# Altium schematic sheet interface_temperature.SchDoc
size A; SheetNumber: 20
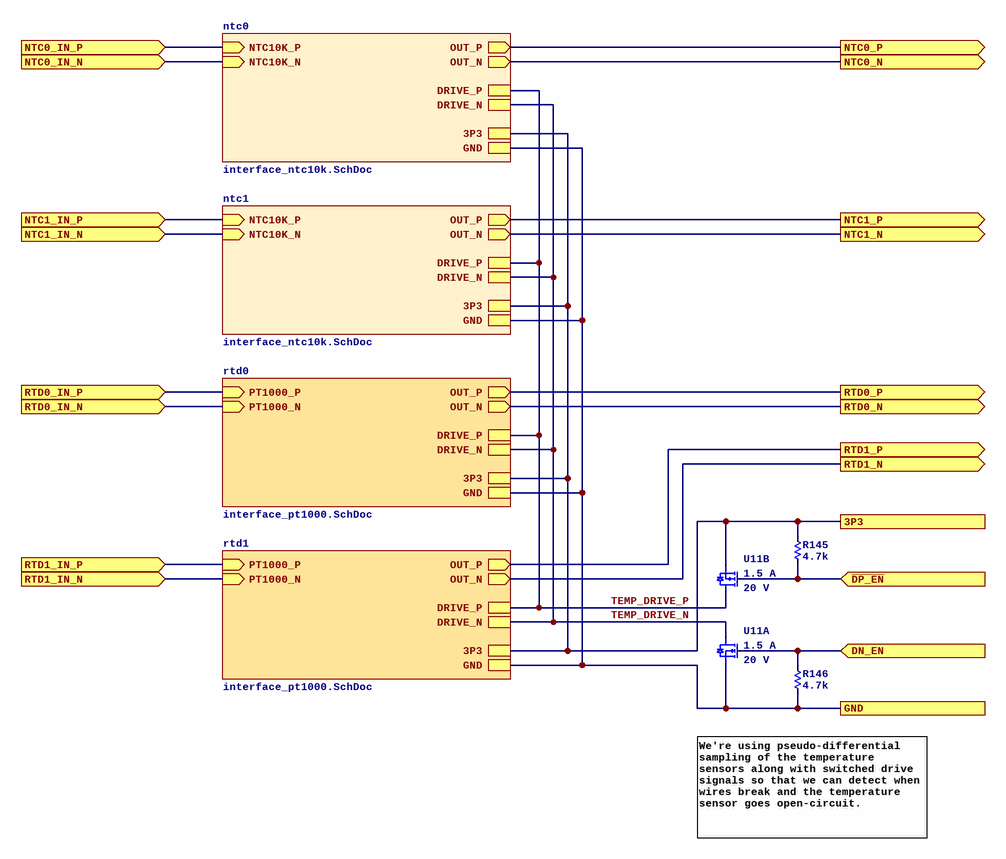
[diagram p0: interface_temperature.SchDoc]

## Parts
R145  Resistance: 4.7k  [R0402_0.40MM]  (hidden comment: ERJ-2RKF4701X)
R146  Resistance: 4.7k  [R0402_0.40MM]  (hidden comment: ERJ-2RKF4701X)
U11  Current: 1.5 A  Voltage: 20 V  [6TSOT23]  (hidden comment: BSL215CH6327XTSA1)  (parts A,B of 2)

## Sub-sheets
ntc0 = interface_ntc10k.SchDoc: 3P3, GND, DRIVE_N, DRIVE_P, OUT_P (out), OUT_N (out), NTC10K_P (in), NTC10K_N (in)
ntc1 = interface_ntc10k.SchDoc: 3P3, GND, DRIVE_N, DRIVE_P, OUT_P (out), OUT_N (out), NTC10K_P (in), NTC10K_N (in)
rtd0 = interface_pt1000.SchDoc: 3P3, GND, PT1000_P (in), PT1000_N (in), DRIVE_N, DRIVE_P, OUT_P (out), OUT_N (out)
rtd1 = interface_pt1000.SchDoc: 3P3, GND, PT1000_P (in), PT1000_N (in), DRIVE_N, DRIVE_P, OUT_P (out), OUT_N (out)

## Ports
3P3, DN_EN (in), GND, NTC0_IN_N (in), NTC0_IN_P (in), NTC0_N (out), NTC0_P (out), NTC1_IN_N (in), NTC1_IN_P (in), NTC1_N (out), NTC1_P (out), RTD0_IN_N (in), RTD0_IN_P (in), RTD0_N (out), RTD0_P (out), RTD1_IN_N (in), RTD1_IN_P (in), RTD1_N (out), RTD1_P (out), ~{DP_EN} (in)

## Nets
3P3: R145.1 U11.2 ; port 3P3, sheet ntc0/3P3, sheet rtd0/3P3, sheet ntc1/3P3, sheet rtd1/3P3
~{DP_EN}: R145.2 U11.3 ; port ~{DP_EN}
DN_EN: R146.1 U11.1 ; port DN_EN
GND: R146.2 U11.5 ; port GND, sheet ntc0/GND, sheet rtd0/GND, sheet ntc1/GND, sheet rtd1/GND
NTC0_IN_N: port NTC0_IN_N, sheet ntc0/NTC10K_N
NTC0_IN_P: port NTC0_IN_P, sheet ntc0/NTC10K_P
NTC0_N: port NTC0_N, sheet ntc0/OUT_N
NTC0_P: port NTC0_P, sheet ntc0/OUT_P
NTC1_IN_N: port NTC1_IN_N, sheet ntc1/NTC10K_N
NTC1_IN_P: port NTC1_IN_P, sheet ntc1/NTC10K_P
NTC1_N: port NTC1_N, sheet ntc1/OUT_N
NTC1_P: port NTC1_P, sheet ntc1/OUT_P
RTD0_IN_N: port RTD0_IN_N, sheet rtd0/PT1000_N
RTD0_IN_P: port RTD0_IN_P, sheet rtd0/PT1000_P
RTD0_N: port RTD0_N, sheet rtd0/OUT_N
RTD0_P: port RTD0_P, sheet rtd0/OUT_P
RTD1_IN_N: port RTD1_IN_N, sheet rtd1/PT1000_N
RTD1_IN_P: port RTD1_IN_P, sheet rtd1/PT1000_P
RTD1_N: port RTD1_N, sheet rtd1/OUT_N
RTD1_P: port RTD1_P, sheet rtd1/OUT_P
TEMP_DRIVE_N: U11.6 ; sheet ntc0/DRIVE_N, sheet rtd0/DRIVE_N, sheet ntc1/DRIVE_N, sheet rtd1/DRIVE_N
TEMP_DRIVE_P: U11.4 ; sheet ntc0/DRIVE_P, sheet rtd0/DRIVE_P, sheet ntc1/DRIVE_P, sheet rtd1/DRIVE_P

## Notes on the sheet
- We're using pseudo-differential sampling of the temperature sensors along with switched drive signals so that we can detect when wires break and the temperature sensor goes open-circuit.

## Library data of the parts
R145 R146 = ERJ-2RKF4701X: RES SMD 4.7K OHM 1% 1/10W 0402; Manufacturer: Panasonic Electronic Components; Unit Price (USD): 0.1; Power (Watts): 0.1W, 1/10W; Temperature Coefficient: ±100ppm/°C; ComponentLink1Description: Datasheet; ComponentLink1URL: https://industrial.panasonic.com/cdbs/www-data/pdf/RDA0000/AOA0000C304.pdf; Series: ERJ; Tolerance: ±1%; Composition: Thick Film; Features: Automotive AEC-Q200; Operating Temperature: -55°C ~ 155°C; Package / Case: 0402 (1005 Metric); Supplier Device Package: 0402; Size / Dimension: 0.039" L x 0.020" W (1.00mm x 0.50mm); Height - Seated (Max): 0.016" (0.40mm); Supplier 1: Digikey; Supplier Part Number 1: P4.70KLCT-ND; Manufacturer Part Number: ERJ-2RKF4701X
U11 = NFET_PFET_20V_BSL215CH6327XTSA1: Dual N/P-Channel 20V 140/150 mOhm 0.73/3nC OptiMOS Small Signal Mosfet - TSOP-6; Manufacturer: Infineon; Supplier 1: Digikey; Supplier Part Number 1: BSL215CH6327XTSA1CT-ND; Manufacturer Part Number: BSL215CH6327XTSA1; Supplier 2: LCSC; Supplier Part Number 2: C3279333